# Altium project control_panel_PCB.PrjPcb
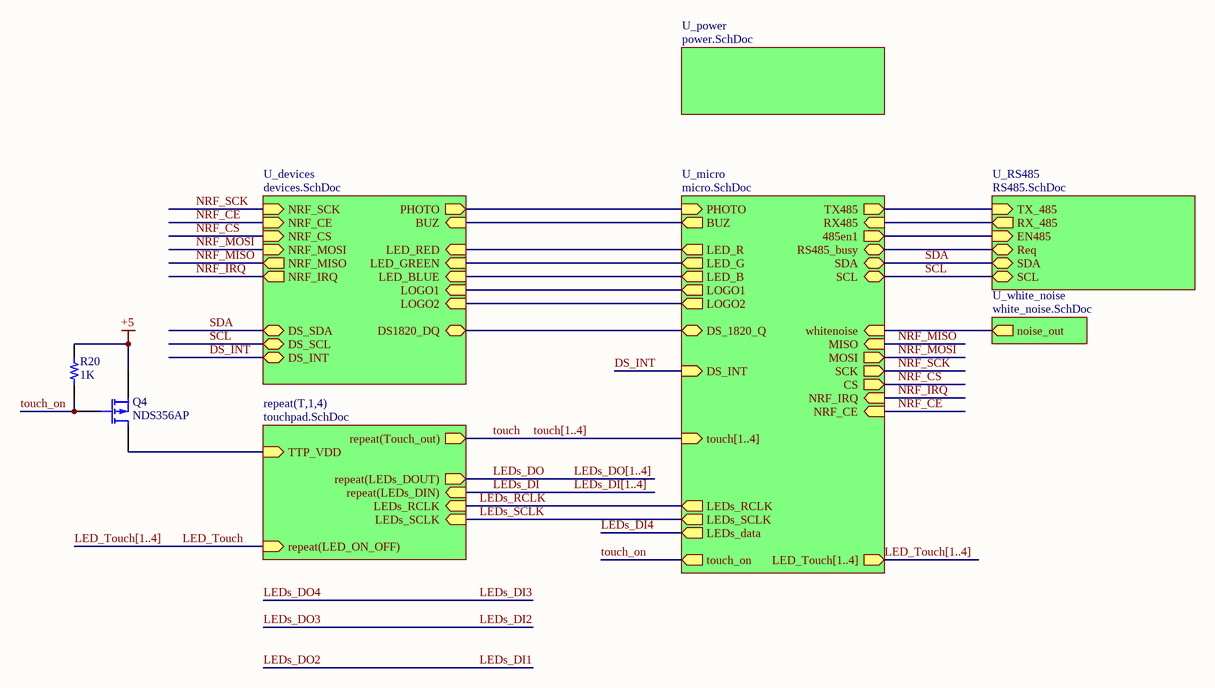
[diagram p0: top.SchDoc]
7 sheets, 279 parts. Net scope: hierarchical (ports join the sheet entries above them; power ports are global).
Board files: control_panel2.PcbDoc, control_panel.PcbDoc
Sheets:
  top.SchDoc
    U_micro = micro.SchDoc
    U_power = power.SchDoc
    U_RS485 = RS485.SchDoc
    U_white_noise = white_noise.SchDoc
    U_devices = devices.SchDoc
    T1 = touchpad.SchDoc
    T2 = touchpad.SchDoc
    T3 = touchpad.SchDoc
    T4 = touchpad.SchDoc

## Sheet top.SchDoc
size A4

### Parts
Q4  NDS356AP  [soT95p280x130-3n]
R20  1K  [0603R]

### Sub-sheets
repeat(T,1,4) = touchpad.SchDoc: TTP_VDD (in), repeat(Touch_out) (out), repeat(LEDs_DIN) (in), repeat(LEDs_DOUT) (out), LEDs_RCLK (in), LEDs_SCLK (in), repeat(LED_ON_OFF) (in)
U_devices = devices.SchDoc: NRF_MISO (out), NRF_SCK (in), NRF_CE (in), NRF_IRQ (out), NRF_CS (in), NRF_MOSI (in), BUZ (in), PHOTO (out), DS_SCL (bidir), DS_SDA (bidir), DS_INT (bidir), DS1820_DQ (bidir), LED_RED (in), LED_GREEN (in), LED_BLUE (in), LOGO1 (in), LOGO2 (in)
U_micro = micro.SchDoc: whitenoise (in), SCL (bidir), SDA (bidir), RX485 (in), TX485 (out), 485en1 (out), RS485_busy (bidir), MISO (in), LED_G (out), SCK (out), NRF_CE (in), LED_B (out), NRF_IRQ (in), DS_1820_Q (bidir), PHOTO (in), DS_INT (in), LED_R (out), MOSI (out), CS (out), BUZ (out), touch_on (out), LEDs_RCLK (out), LEDs_SCLK (out), LEDs_data (out), touch[1..4] (in), LED_Touch[1..4] (out), LOGO1 (out), LOGO2 (out)
U_power = power.SchDoc: no entries
U_RS485 = RS485.SchDoc: RX_485 (out), EN485 (in), TX_485 (in), Req (bidir), SDA (bidir), SCL (bidir)
U_white_noise = white_noise.SchDoc: noise_out (out)

### Nets
+5: Q4.3(S) R20.1
485en: sheet U_micro/485en1, sheet U_RS485/EN485
DS_INT: sheet U_micro/DS_INT, sheet U_devices/DS_INT
LED_Touch: sheet repeat(T,1,4)/repeat(LED_ON_OFF)
LEDs_DI: sheet repeat(T,1,4)/repeat(LEDs_DIN)
LEDs_DO: sheet repeat(T,1,4)/repeat(LEDs_DOUT)
LEDs_RCLK: sheet U_micro/LEDs_RCLK, sheet repeat(T,1,4)/LEDs_RCLK
LEDs_SCLK: sheet U_micro/LEDs_SCLK, sheet repeat(T,1,4)/LEDs_SCLK
NRF_CE: sheet U_micro/NRF_CE, sheet U_devices/NRF_CE
NRF_CS: sheet U_micro/CS, sheet U_devices/NRF_CS  [project net CS]
NRF_IRQ: sheet U_micro/NRF_IRQ, sheet U_devices/NRF_IRQ
NRF_MISO: sheet U_micro/MISO, sheet U_devices/NRF_MISO  [project net MISO]
NRF_MOSI: sheet U_micro/MOSI, sheet U_devices/NRF_MOSI  [project net MOSI]
NRF_SCK: sheet U_micro/SCK, sheet U_devices/NRF_SCK
photo: sheet U_micro/PHOTO, sheet U_devices/PHOTO
RS48_busy: sheet U_micro/RS485_busy, sheet U_RS485/Req
RX485: sheet U_micro/RX485, sheet U_RS485/RX_485
SCL: sheet U_micro/SCL, sheet U_RS485/SCL, sheet U_devices/DS_SCL
SDA: sheet U_micro/SDA, sheet U_RS485/SDA, sheet U_devices/DS_SDA
touch: sheet repeat(T,1,4)/repeat(Touch_out)  [also labelled touch[1..4]]
touch_on: Q4.2(G) R20.2 ; sheet U_micro/touch_on
TTP_VDD: Q4.1(D) ; sheet repeat(T,1,4)/TTP_VDD
TX485: sheet U_micro/TX485, sheet U_RS485/TX_485
whitenoise: sheet U_micro/whitenoise, sheet U_white_noise/noise_out
NetR26_1: sheet U_micro/DS_1820_Q, sheet U_devices/DS1820_DQ
NetR27_1: sheet U_micro/LED_R, sheet U_devices/LED_RED
NetR27_2: sheet U_micro/LED_G, sheet U_devices/LED_GREEN
NetR27_3: sheet U_micro/LED_B, sheet U_devices/LED_BLUE
NetR27_4: sheet U_micro/LOGO1, sheet U_devices/LOGO1
NetR61_1: sheet U_micro/LOGO2, sheet U_devices/LOGO2
NetSP1_1: sheet U_micro/BUZ, sheet U_devices/BUZ

### Buses and harness runs
bus LED_Touch[1..4]
bus LED_Touch[1..4] = sheet U_micro/LED_Touch[1..4]
bus LEDs_DI[1..4]
bus LEDs_DO[1..4]

### Library data of the parts
Q4 = MOSFET-P: P-Channel MOSFET SOT23; pin to pad: 1>3 2>1 3>2; Published: 8-Jun-2000; LatestRevisionDate: 17-Jul-2002; LatestRevisionNote: Re-released for DXP Platform.; PackageVersion: 1995/1996; PackageReference: E3; Publisher: Altium Limited; PackageDescription: TO, Flat Index; 3 In-Line, Axial Leads; Body Dia. 4.6mm; Lead Dia. 0.5 mm (max)
R20 = Resistor: RES SMD 0603; Part Number: RCS0805100KFKEA; Value: 1K

## Sheet micro.SchDoc
size A3
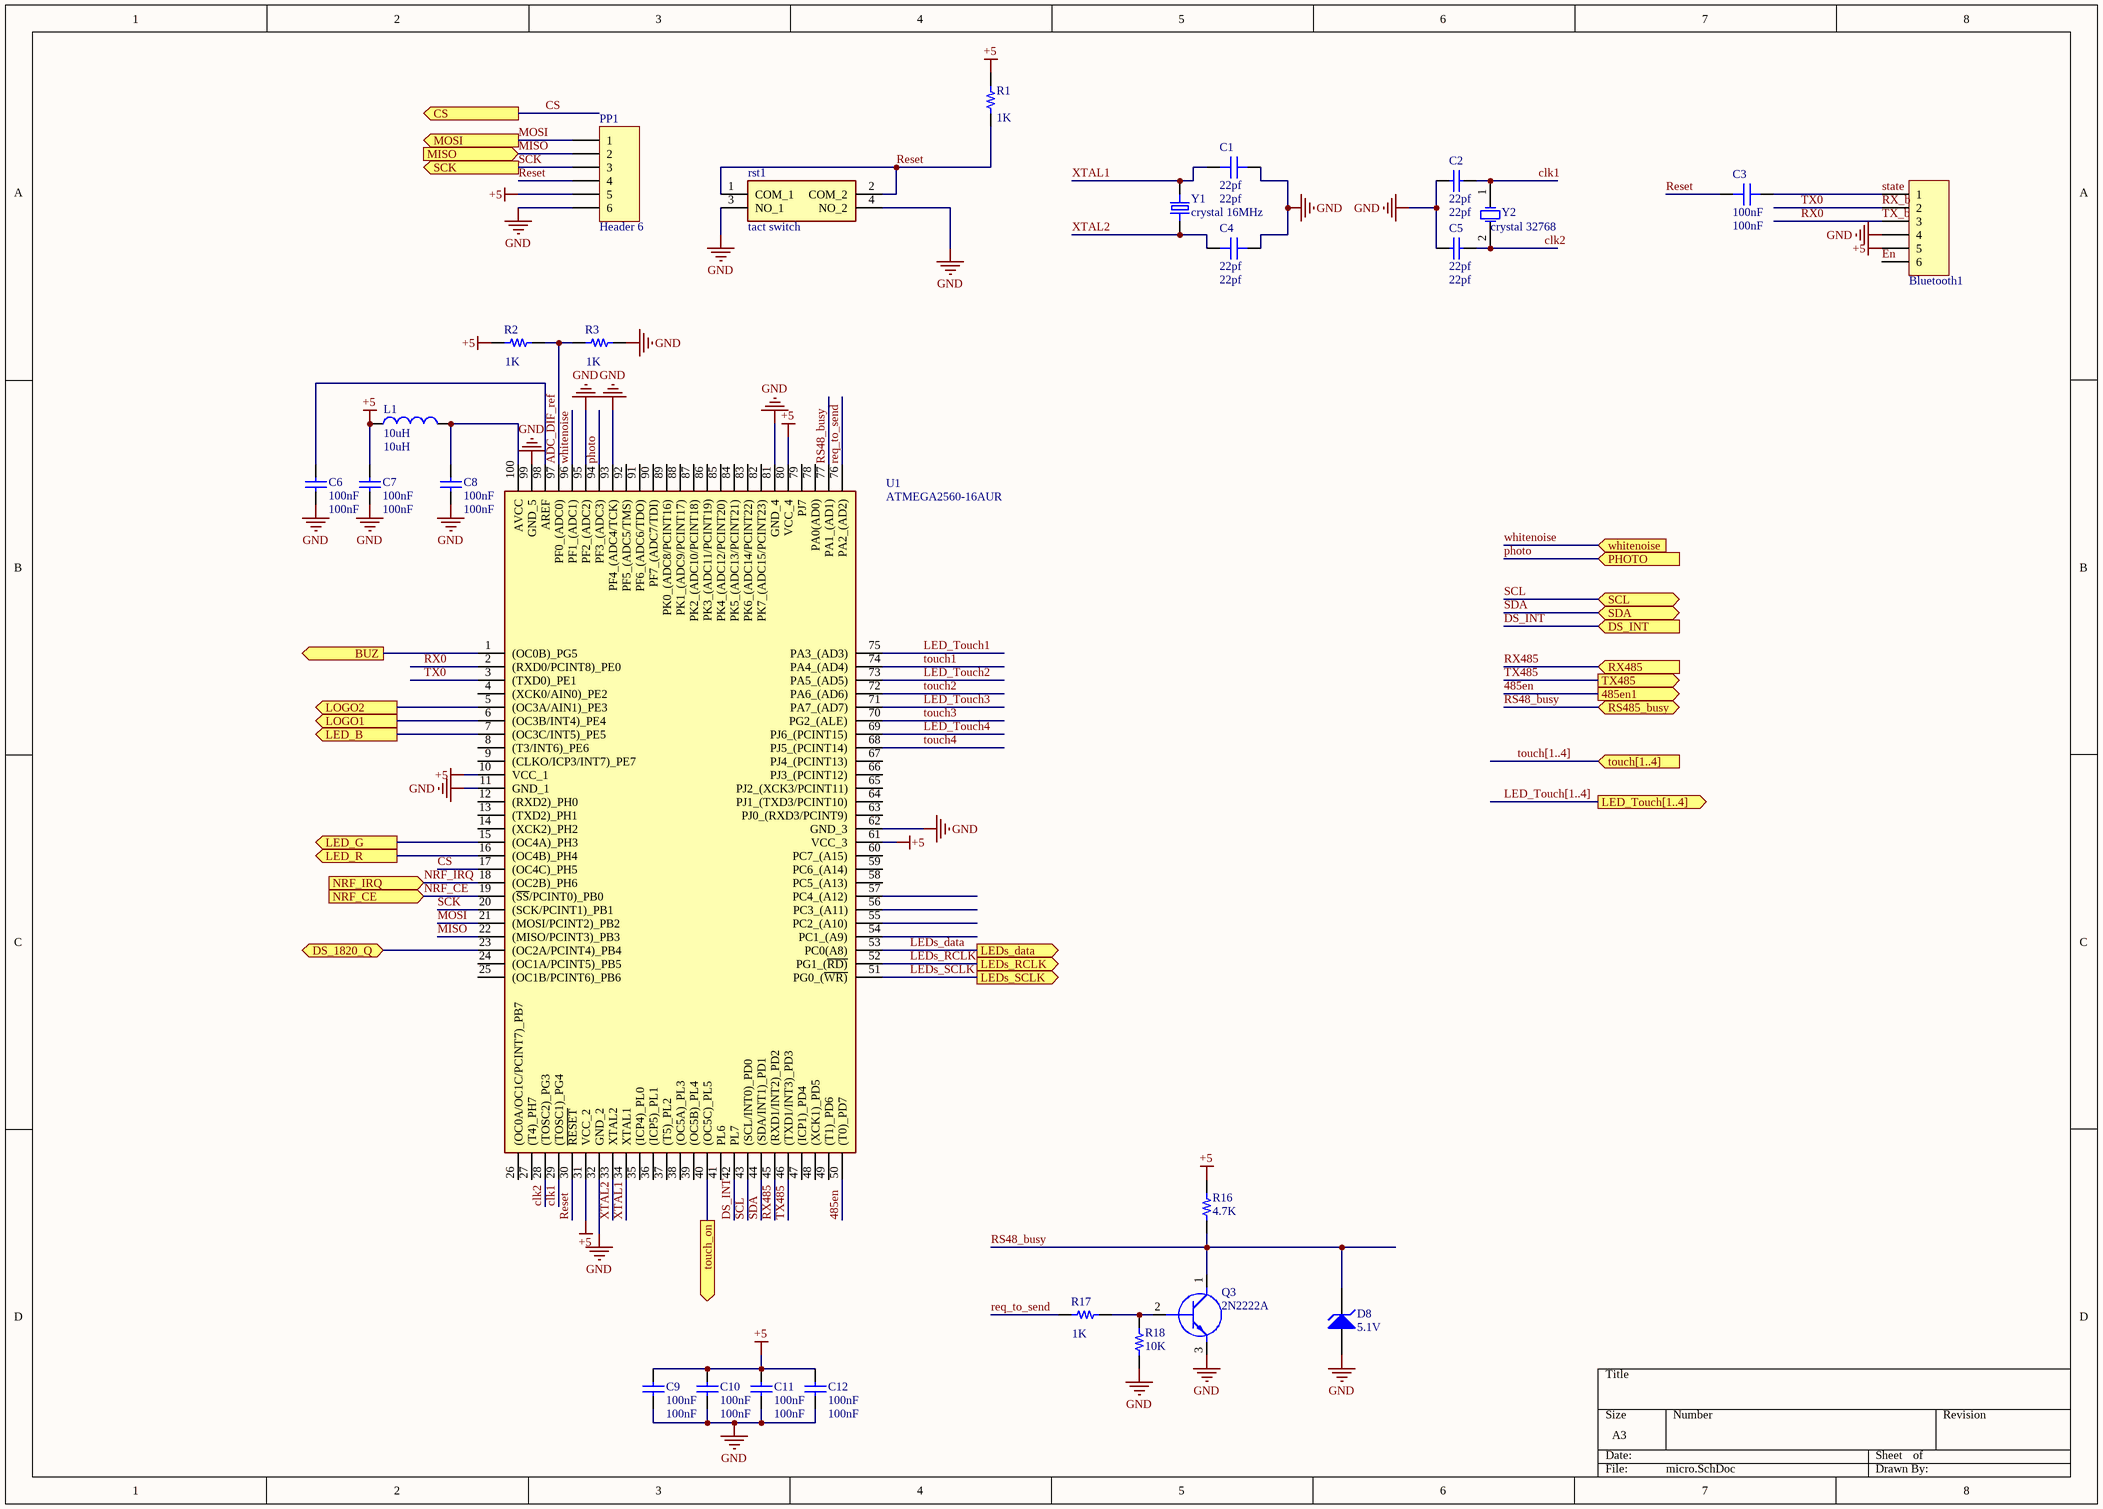
[diagram p1: micro.SchDoc]

### Parts
Bluetooth1  Header 6  [H-1x6]  (value not drawn)
C1  22pf  [0603C]
C2  22pf  [0603C]
C3  100nF  [0603C]
C4  22pf  [0603C]
C5  22pf  [0603C]
C6  100nF  [0603C]
C7  100nF  [0603C]
C8  100nF  [0603C]
C9  100nF  [0603C]
C10  100nF  [0603C]
C11  100nF  [0603C]
C12  100nF  [0603C]
D8  5.1V  [Diode 1n4148 SMD]
L1  10uH  [IND1206]
PP1  Header 6  [HDR1X6]
Q3  2N2222A  [soT95p280x130-3n]
R1  1K  [0603R]
R2  1K  [0603R]
R3  1K  [0603R]
R16  4.7K  [0603R]
R17  1K  [0603R]
R18  10K  [0603R]
rst1  tact switch  [DTSM63NVB]
U1  ATMEGA2560-16AUR  [QFP50P1600X1600X120-100N]
Y1  crystal 16MHz  [XTAL_ECS-180-S-5P-DN-TR]
Y2  crystal 32768  [XTAL RTC]

### Ports
485en1 (out), BUZ (out), CS (out), DS_1820_Q (bidir), DS_INT (in), LED_B (out), LED_G (out), LED_R (out), LED_Touch[1..4] (out), LEDs_data (out), LEDs_RCLK (out), LEDs_SCLK (out), LOGO1 (out), LOGO2 (out), MISO (in), MOSI (out), NRF_CE (in), NRF_IRQ (in), PHOTO (in), RS485_busy (bidir), RX485 (in), SCK (out), SCL (bidir), SDA (bidir), touch[1..4] (in), touch_on (out), TX485 (out), whitenoise (in)

### Nets
+5: Bluetooth1.5 C7.1 C9.1 C10.1 C11.1 C12.1 L1.1 PP1.5 R1.2 R2.2 R16.1 U1.10(VCC_1) U1.31(VCC_2) U1.61(VCC_3) U1.80(VCC_4)
GND: Bluetooth1.4 C1.1 C2.1 C4.1 C5.2 C6.2 C7.2 C8.2 C9.2 C10.2 C11.2 C12.2 D8.1(A) PP1.6 Q3.3(E) R3.1 R18.2 rst1.3(NO_1) rst1.4(NO_2) U1.11(GND_1) U1.32(GND_2) U1.62(GND_3) U1.81(GND_4) U1.93(PF4_(ADC4/TCK)) U1.95(PF2_(ADC2)) U1.99(GND_5)
485en: U1.50((T0)_PD7) ; port 485en1
ADC_DIF_ref: R2.1 R3.2 U1.97(PF0_(ADC0))
clk1: C2.2 U1.29((TOSC1)_PG4) Y2.1(OSC1)
clk2: C5.1 U1.28((TOSC2)_PG3) Y2.2(OSC2)
CS: U1.17((OC4C)_PH5) ; port CS
DS_INT: U1.42(PL7) ; port DS_INT
En: Bluetooth1.6
LED_Touch1: U1.75(PA3_(AD3))
LED_Touch2: U1.73(PA5_(AD5))
LED_Touch3: U1.71(PA7_(AD7))
LED_Touch4: U1.69(PJ6_(PCINT15))
LEDs_data: U1.53(PC0(A8)) ; port LEDs_data
LEDs_RCLK: U1.52(PG1_(~{RD)}) ; port LEDs_RCLK
LEDs_SCLK: U1.51(PG0_(~{WR)}) ; port LEDs_SCLK
MISO: PP1.2 U1.22((MISO/PCINT3)_PB3) ; port MISO
MOSI: PP1.1 U1.21((MOSI/PCINT2)_PB2) ; port MOSI
NRF_CE: U1.19((~{SS}/PCINT0)_PB0) ; port NRF_CE
NRF_IRQ: U1.18((OC2B)_PH6) ; port NRF_IRQ
photo: U1.94(PF3_(ADC3)) ; port PHOTO
req_to_send: R17.2 U1.76(PA2_(AD2))
Reset: C3.2 PP1.4 R1.1 rst1.1(COM_1) rst1.2(COM_2) U1.30(~{RESET})
RS48_busy: D8.2(K) Q3.1(C) R16.2 U1.77(PA1_(AD1)) ; port RS485_busy
RX0: Bluetooth1.3 U1.2((RXD0/PCINT8)_PE0)  [also labelled TX_b]
RX485: U1.45((RXD1/INT2)_PD2) ; port RX485
RX_b: Bluetooth1.2 U1.3((TXD0)_PE1)  [also labelled TX0]
SCK: PP1.3 U1.20((SCK/PCINT1)_PB1) ; port SCK  [project net NRF_SCK]
SCL: U1.43((SCL/INT0)_PD0) ; port SCL
SDA: U1.44((SDA/INT1)_PD1) ; port SDA
state: Bluetooth1.1 C3.1
touch1: U1.74(PA4_(AD4))
touch2: U1.72(PA6_(AD6))
touch3: U1.70(PG2_(ALE))
touch4: U1.68(PJ5_(PCINT14))
touch_on: U1.40((OC5C)_PL5) ; port touch_on
TX485: U1.46((TXD1/INT3)_PD3) ; port TX485
whitenoise: U1.96(PF1_(ADC1)) ; port whitenoise
XTAL1: C1.2 U1.34(XTAL1) Y1.2
XTAL2: C4.2 U1.33(XTAL2) Y1.1
NetC6_1: C6.1 U1.98(AREF)
NetC8_1: C8.1 L1.2 U1.100(AVCC)
NetQ3_2: Q3.2(B) R17.1 R18.1
NetR26_1: U1.23((OC2A/PCINT4)_PB4) ; port DS_1820_Q
NetR27_1: U1.16((OC4B)_PH4) ; port LED_R
NetR27_2: U1.15((OC4A)_PH3) ; port LED_G
NetR27_3: U1.7((OC3C/INT5)_PE5) ; port LED_B
NetR27_4: U1.6((OC3B/INT4)_PE4) ; port LOGO1
NetR61_1: U1.5((OC3A/AIN1)_PE3) ; port LOGO2
NetSP1_1: U1.1((OC0B)_PG5) ; port BUZ

Not connected (* = marked no-connect by the designer): U1 4((XCK0/AIN0)_PE2) 8((T3/INT6)_PE6) 9((CLKO/ICP3/INT7)_PE7) 12((RXD2)_PH0) 13((TXD2)_PH1) 14((XCK2)_PH2) 24((OC1A/PCINT5)_PB5) 25((OC1B/PCINT6)_PB6) 26((OC0A/OC1C/PCINT7)_PB7) 27((T4)_PH7) 35((ICP4)_PL0) 36((ICP5)_PL1) 37((T5)_PL2) 38((OC5A)_PL3) 39((OC5B)_PL4) 41(PL6) 47((ICP1)_PD4) 48((XCK1)_PD5) 49((T1)_PD6) 54(PC1_(A9)) 55(PC2_(A10)) 56(PC3_(A11)) 57(PC4_(A12)) 58(PC5_(A13)) 59(PC6_(A14)) 60(PC7_(A15)) 63(PJ0_(RXD3/PCINT9)) 64(PJ1_(TXD3/PCINT10)) 65(PJ2_(XCK3/PCINT11)) 66(PJ3_(PCINT12)) 67(PJ4_(PCINT13)) 78(PA0(AD0)) 79(PJ7) 82(PK7_(ADC15/PCINT23)) 83(PK6_(ADC14/PCINT22)) 84(PK5_(ADC13/PCINT21)) 85(PK4_(ADC12/PCINT20)) 86(PK3_(ADC11/PCINT19)) 87(PK2_(ADC10/PCINT18)) 88(PK1_(ADC9/PCINT17)) 89(PK0_(ADC8/PCINT16)) 90(PF7_(ADC7/TDI)) 91(PF6_(ADC6/TDO)) 92(PF5_(ADC5/TMS))

### Buses and harness runs
bus LED_Touch[1..4] = port LED_Touch[1..4]
bus touch[1..4] = port touch[1..4]

### Library data of the parts
Bluetooth1 = H-1x6: Header, 6-Pin , female; pin to pad: 2>2.5
C1 C3 C4 = Capacitor: CAP SMD 0603; Part Number: C0805X106K9RAC7800
  C1 C4: Value: 22pf
  C3: Value: 100nF
C2 C5-C12 = Cap: CAP SMD 0603; Published: 8-Jun-2000; LatestRevisionDate: 17-Jul-2002; LatestRevisionNote: Re-released for DXP Platform.; PackageReference: RAD-0.3; Publisher: Altium Limited; PackageDescription: Radial Cap, Thru-Hole; 2 Leads; 0.3 in Pin Spacing
  C2 C5: Value: 22pf
  C6-C12: Value: 100nF
D8 = D Zener: Zener Diode 5.1v; Published: 8-Jun-2000; LatestRevisionDate: 17-Jul-2002; LatestRevisionNote: Re-released for DXP Platform.; PackageReference: DIODE-0.7; Publisher: Altium Limited; PackageDescription: Diode, Thru-Hole; 2 Leads; 0.7 in Pin Spacing
L1 = Inductor: Inductor 1206; Code_IEC: 1005; Published: 8-Jun-2000; LatestRevisionDate: 29-May-2009; LatestRevisionNote: IPC-7351 Footprint Added.; PackageReference: 0402-A; Publisher: Altium Limited; PackageDescription: Chip Inductor; Code_JEITA: 0402; Value: 10uH
PP1 = Header 6: Header, 6-Pin , female; LatestRevisionDate: 17-Jul-2002; LatestRevisionNote: Re-released for DXP Platform.; Publisher: Altium Limited
Q3 = 2N2222A: Transistor BJT NPN SMD; pin to pad: 1>3 2>1 3>2; Manufacturer_Name: Foshan Blue Rocket Elec; Datasheet Link: https://datasheet.lcsc.com/szlcsc/1901291437_Foshan-Blue-Rocket-Elec-2N2222A_C358533.pdf; Height: 4.7mm; Manufacturer_Part_Number: 2N2222A
R1-R3 R16-R18 = Resistor: as R20 on sheet top
  R1-R3 R17: Value: 1K
  R16: Value: 4.7K
  R18: Value: 10K
rst1 = DTSM-66R-V-T_R: Push Button SMD - 4PIN; Manufacturer_Name: Diptronics; Manufacturer_Part_Number: DTSM-66R-V-T/R; Datasheet Link: https://www.mouser.co.uk/datasheet/2/910/464_DTSMJ-6-1571536.pdf; Height: 7.1mm; Mouser Part Number: 113-DTSM66RVTR; Mouser Price/Stock: https://www.mouser.co.uk/ProductDetail/Diptronics/DTSM-66R-V-T-R?qs=MLItCLRbWsxl2%252BVY862AIw%3D%3D
U1 = ATMEGA2560-16AUR: ATMEGA2560-LQFP100; Manufacturer_Name: Microchip; Datasheet Link: http://ww1.microchip.com/downloads/en/DeviceDoc/Atmel-2549-8-bit-AVR-Microcontroller-ATmega640-1280-1281-2560-2561_datasheet.pdf; Height: 1.2mm; Manufacturer_Part_Number: ATMEGA2560-16AUR; Mouser Part Number: 556-ATMEGA2560-16AUR; Mouser Price/Stock: https://www.mouser.co.uk/ProductDetail/Microchip-Technology-Atmel/ATMEGA2560-16AUR?qs=6Dg1WZIWLC5tcX5fO8xzXQ%3D%3D; Arrow Part Number: ATMEGA2560-16AUR; Arrow Price/Stock: https://www.arrow.com/en/products/atmega2560-16aur/microchip-technology?region=nac
Y1 = ECS-180-S-5P-DN-TR: Crystals 16MHz; MF: ECS International; MP: ECS-180-S-5P-DN-TR; Value: 16MHz; SnapEDA_Link: https://www.snapeda.com/parts/ECS-180-S-5P-DN-TR/ECS%20International/view-part/2547669/?ref=snap; Price: None; Package: HC49/US ECS International; Availability: Unavailable
Y2 = XTAL: RTC crystal; Company: E.P.I.L; Value: 32768; Design Date: 11/04/2011

## Sheet power.SchDoc
size A4
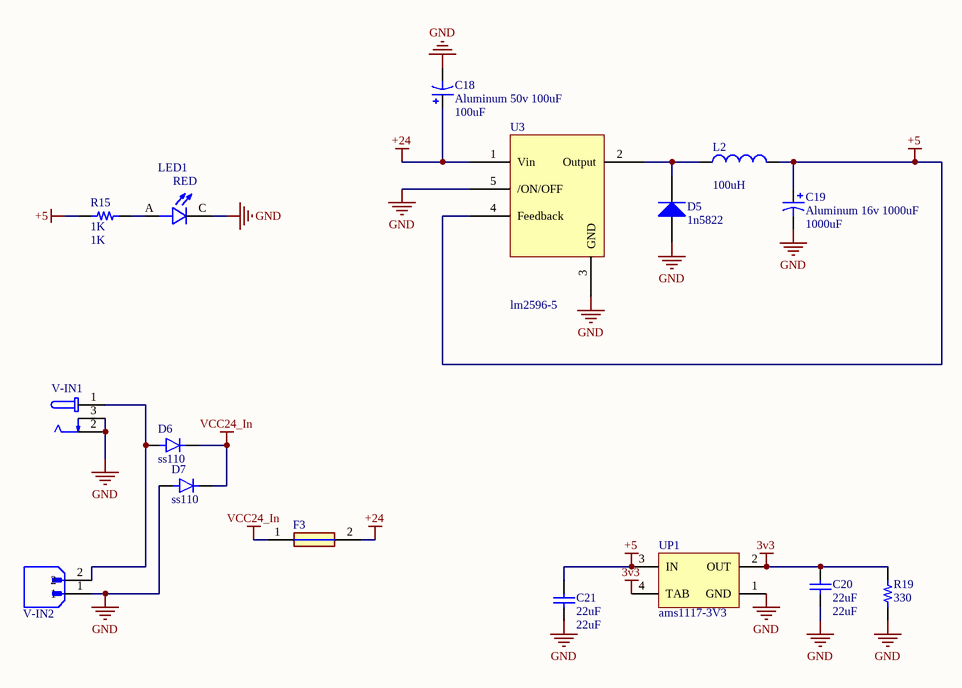
[diagram p2: power.SchDoc]

### Parts
C18  Aluminum 50v 100uF  value 100uF  [Cap SMD 100UF 35~50v]
C19  Aluminum 16v 1000uF  value 1000uF  [CAP SMD 1000UF 16V]
C20  22uF  [0603C]
C21  22uF  [0603C]
D5  1n5822  [SMA DIODE 2]
D6  ss110  [ss110]
D7  ss110  [ss110]
F3  fuse 2amp  [1206 FUSE]  (value not drawn)
L2  value 100uH  [inductor]  (hidden comment: inductor 100uH)
LED1  LED RED  [LED_7012X1]  (value not drawn)
R15  1K  [0603R]
R19  330  [0603R]
U3  lm2596-5  [2596]
UP1  ams1117-3V3  [SOT223]
V-IN1  DC jack power  [GCT_DCJ235-05-A-XX-X_REVA]  (value not drawn)
V-IN2  Phoenix  [AMPHENOL_OQ0271510000G]  (value not drawn)

### Nets
3v3: C20.2 R19.1 UP1.2(OUT) UP1.4(TAB)
+5: C19.1 C21.2 L2.2 R15.1 U3.4(Feedback) UP1.3(IN)
+24: C18.1 F3.2 U3.1(Vin)
GND: C18.2 C19.2 C20.1 C21.1 D5.1(A) D7.A LED1.C R19.2 U3.3(GND) U3.5(/ON/OFF) UP1.1(GND) V-IN1.2 V-IN1.3 V-IN2.1
VCC24_In: D6.C(K) D7.C(K) F3.1
NetD5_2: D5.2(K) L2.1 U3.2(Output)
NetD6_A: D6.A V-IN1.1 V-IN2.2
NetLED1_A: LED1.A R15.2

### Notes on the sheet
- (in symbol 7012X1) RED

### Library data of the parts
C18 C19 = Cap Pol1: CAP POLAR SMD; Published: 8-Jun-2000; LatestRevisionDate: 17-Jul-2002; LatestRevisionNote: Re-released for DXP Platform.; PackageReference: RB7.6-15; Publisher: Altium Limited; PackageDescription: Polarized Capacitor (Radial); 2 Leads
C20 C21 = Cap: CAP SMD 0603; Published: 8-Jun-2000; LatestRevisionDate: 17-Jul-2002; LatestRevisionNote: Re-released for DXP Platform.; PackageReference: RAD-0.3; Publisher: Altium Limited; PackageDescription: Radial Cap, Thru-Hole; 2 Leads; 0.3 in Pin Spacing; Value: 22uF
D5 = Diode 1N4007: 1 Amp schottky Diode SMA; Published: 8-Jun-2000; LatestRevisionDate: 17-Jul-2002; LatestRevisionNote: Re-released for DXP Platform.; DatasheetVersion: 1998; PackageVersion: Aug-1999; PackageReference: DO-41; Publisher: Altium Limited; PackageDescription: Diode, Axial; Body 5.2 x 2.7 mm (LxDia. max), Lead Dia. 0.86 mm (max); Code_JEDEC: DO-204-AL; ComponentLink1Description: Manufacturer Link; ComponentLink1URL: http://www.fairchildsemi.com/; ComponentLink2Description: Datasheet; ComponentLink2URL: http://www.fairchildsemi.com/ds/1N%2F1N4001.pdf
D6 D7 = SBR0560S1-7: Diode Super Barrier 60V 500mA Surface Mount SOD-123; MF: Diodes Inc.; MP: SBR0560S1-7; Availability: Unavailable; SnapEDA_Link: https://www.snapeda.com/parts/SBR0560S1-7/Diodes%20Inc./view-part/491648/?ref=snap; Package: SOD-123 Diodes Inc.; Value: *; Price: None
F3 = 1206SFS200F_63-2: Fuse 1206; Manufacturer_Name: TE Connectivity; Manufacturer_Part_Number: 1206SFS200F/63-2; Datasheet Link: http://docs-emea.rs-online.com/webdocs/13b6/0900766b813b6e27.pdf; Height: 1.17mm
L2 = Inductor: Inductor 12*12mm; Code_IEC: 1005; Published: 8-Jun-2000; LatestRevisionDate: 29-May-2009; LatestRevisionNote: IPC-7351 Footprint Added.; PackageReference: 0402-A; Publisher: Altium Limited; PackageDescription: Chip Inductor; Code_JEITA: 0402
LED1 = 7012X1: LED SMD 0805 RED; Package: None; Price: None; Value: *; MP: 7012X1; Availability: Unavailable
R15 R19 = Resistor: as R20 on sheet top
  R15: Value: 1K
  R19: Value: 330
U3 = lm2596
UP1 = AMS1117-x.x: 3.3 Volt, 800mA SOT-223; Designer: Ali Hafizi; Data: 16-12-2016
V-IN1 = DCJ235-05-A-XX-X_REVA: Dc Power Jack on-board; MF: Global Connector Technology; MP: DCJ235-05-A-K1-A; Price: None; Availability: Unavailable; Package: None; SnapEDA_Link: https://www.snapeda.com/parts/DCJ235-05-A-K1-A/Global%20Connector%20Technology/view-part/813042/?ref=snap; Value: *
V-IN2 = OQ0271510000G: Phoenix Terminal Right 2PIN; MF: Amphenol Anytek; MP: OQ0271510000G; Value: *; Check_prices: https://www.snapeda.com/parts/OQ0271510000G/Amphenol/view-part/4075971/?ref=eda; SnapEDA_Link: https://www.snapeda.com/parts/OQ0271510000G/Amphenol/view-part/4075971/?ref=snap; Price: None; Availability: Warning; Purchase-URL: https://pricing.snapeda.com/search/part/OQ0271510000G/?ref=eda; Package: None

## Sheet RS485.SchDoc
size A4
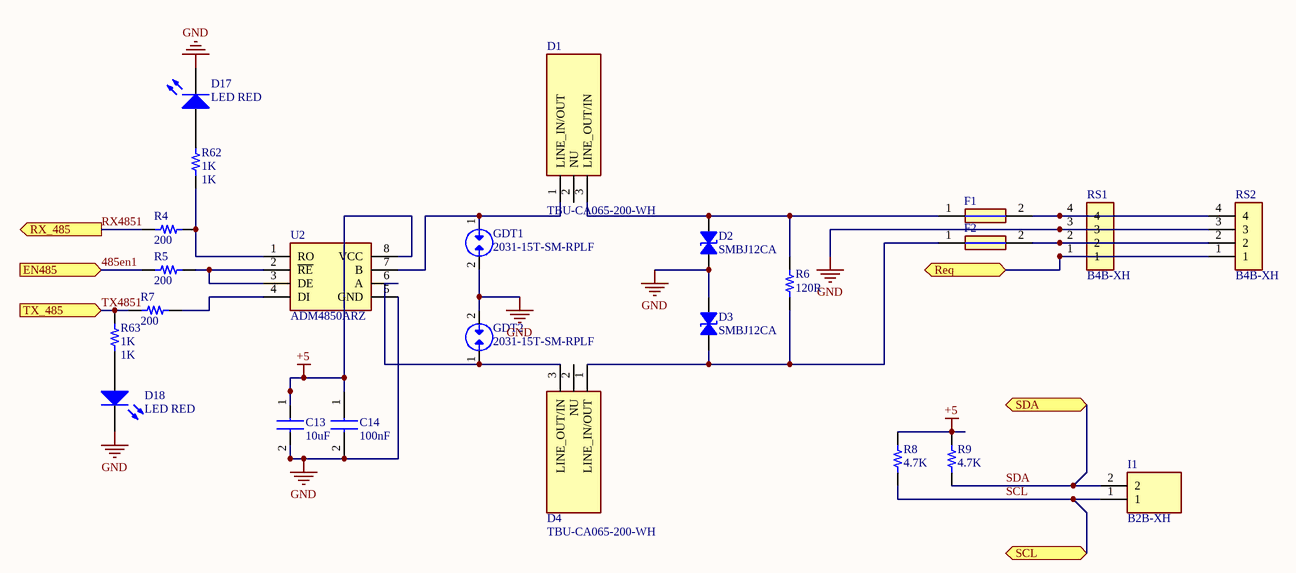
[diagram p3: RS485.SchDoc]

### Parts
C13  10uF  [0603C]
C14  100nF  [0603C]
D1  TBU-CA065-200-WH  [TBUCA025050WH]
D2  SMBJ12CA  [DO214AA SMB]
D3  SMBJ12CA  [DO214AA SMB]
D4  TBU-CA065-200-WH  [TBUCA025050WH]
D17  LED RED  [LED_0805 G]
D18  LED RED  [LED_0805 G]
F1  fuse 100mAmp  [1206 FUSE]  (value not drawn)
F2  fuse 100mAmp  [1206 FUSE]  (value not drawn)
GDT1  2031-15T-SM-RPLF  [TVS_2031-15T-SM-RPLF]
GDT2  2031-15T-SM-RPLF  [TVS_2031-15T-SM-RPLF]
I1  B2B-XH  [JST-B2B-XH]
R4  200  [0603R]
R5  200  [0603R]
R6  120R  [0603R]
R7  200  [0603R]
R8  4.7K  [0603R]
R9  4.7K  [0603R]
R62  1K  [0603R]
R63  1K  [0603R]
RS1  B4B-XH  [JST-B4B-XH]
RS2  B4B-XH  [JST-B4B-XH]
U2  ADM4850ARZ  [SO8_N]

### Ports
EN485 (in), Req (bidir), RX_485 (out), SCL (bidir), SDA (bidir), TX_485 (in)

### Nets
+5: C13.1 C14.1 R8.1 R9.1 U2.8(VCC)
GND: C13.2 C14.2 D2.1 D3.2 D17.2(K) D18.2(K) GDT1.2 GDT2.2 RS1.3 RS2.3 U2.5(GND)
485en1: R5.2 ; port EN485  [project net 485en]
RS48_busy: RS1.1 RS2.1 ; port Req
RX4851: R4.2 ; port RX_485  [project net RX485]
SCL: I1.1 R8.2 ; port SCL
SDA: I1.2 R9.2 ; port SDA
TX4851: R7.2 R63.2 ; port TX_485  [project net TX485]
NetD1_1: D1.1(LINE_IN/OUT) GDT1.1 U2.7(B)
NetD1_3: D1.3(LINE_OUT/IN) D2.2 F1.1 R6.1
NetD3_1: D3.1 D4.1(LINE_IN/OUT) F2.1 R6.2
NetD4_3: D4.3(LINE_OUT/IN) GDT2.1 U2.6(A)
NetD17_1: D17.1(A) R62.1
NetD18_1: D18.1(A) R63.1
NetF1_2: F1.2 RS1.4 RS2.4
NetF2_2: F2.2 RS1.2 RS2.2
NetR4_1: R4.1 R62.2 U2.1(RO)
NetR5_1: R5.1 U2.2(~{RE}) U2.3(DE)
NetR7_1: R7.1 U2.4(DI)

Not connected (* = marked no-connect by the designer): D1 2(NU); D4 2(NU)

### Library data of the parts
C13 C14 = C1206C104Z5UACTU: CAP SMD 0603; Manufacturer_Name: Kemet; Datasheet Link: https://componentsearchengine.com/Datasheets/1/C1206C104Z5UACTU.pdf; Height: 0.88mm; Manufacturer_Part_Number: C1206C104Z5UACTU; Mouser Part Number: 80-C1206C104Z5U; Mouser Price/Stock: https://www.mouser.com/Search/Refine.aspx?Keyword=80-C1206C104Z5U
D1 D4 = TBU-CA065-200-WH: TVS Diode (Bi-directional); Manufacturer_Name: Bourns; Datasheet Link: https://www.bourns.com/data/global/pdfs/TBU-CA.pdf; Height: 1mm; Manufacturer_Part_Number: TBU-CA065-200-WH; Mouser Part Number: 652-TBU-CA065-200-WH; Mouser Price/Stock: https://www.mouser.co.uk/ProductDetail/Bourns/TBU-CA065-200-WH?qs=kLtMOTa49OkdVs42fYbv8A%3D%3D; Arrow Part Number: TBU-CA065-200-WH; Arrow Price/Stock: https://www.arrow.com/en/products/tbu-ca065-200-wh/bourns?region=nac
D2 D3 = SMBJ12CA: TVS DIODE 12V 19.9V SMB; Manufacturer: AVX Corporation; Bidirectional Channels: 1; Current - Peak Pulse (10/1000µs): 30.15A; Power Line Protection: No; Power - Peak Pulse: 600W; Type: Zener; Voltage - Breakdown (Min): 13.3V; Part Number: SMBJ12CA; Applications: General Purpose; ComponentLink1Description: Datasheet; ComponentLink1URL: //media.digikey.com/pdf/Data%20Sheets/AVX%20PDFs/Transient%20Suppression%20Diodes.pdf; ComponentLink2Description: DigiKey Link; ComponentLink2URL: http://digikey.com/product-detail/en/avx-corporation/SMBJ12CA/478-7062-1-ND/3340353; LastUpdated: 9/2/2020 1:28:17 AM; Lifecycle Status: Active; Minimum Order: 1; Mounting Type: Surface Mount; Operating Temperature: -55°C ~ 150°C (TJ); Package / Case: DO-214AA, SMB; Packaging: TapeAndReel; PartId: 9012; Part Status: Active; Price: 0.16; Series: -; Supplier 1: DigiKey; Supplier Part Number 1: 478-7062-1-ND; Supplier Device Package: SMB; Voltage - Clamping (Max) @ Ipp: 19.9V; Voltage - Reverse Standoff (Typ): 12V
D17 D18 = LED0: LED SMD 0805 RED; Published: 8-Jun-2000; LatestRevisionDate: 08-Jul-2005; LatestRevisionNote: Mech Layer 1 removed.; PackageReference: LED-0; Publisher: Altium Limited; PackageDescription: LED; 2 Leads
F1 F2 = 1206SFS200F_63-2: as F3 on sheet power; Datasheet Link: http://docs-emea.rs-online.com/webdocs/13b6/0900766b813b6e27.pdf; Height: 1.17mm
GDT1 GDT2 = 2031-15T-SM-RPLF: Gas Discharge Tube SMD; Package: None; Price: None; Value: *; MP: 2031-15T-SM-RPLF; Availability: Unavailable
I1 = B2B-XH: XH 2pin standing
R4-R9 = CRCW080510K0JNEAIF: RES SMD 0603; Manufacturer: Vishay Dale; Power (Watts): 0.125W, 1/8W; Resistance: 10 kOhms; Temperature Coefficient: ±200ppm/°C; Tolerance: ±5%; Part Number: CRCW080510K0JNEAIF; ComponentLink1Description: Datasheet; ComponentLink1URL: http://www.vishay.com/docs/20024/dcrcwife3.pdf; ComponentLink2Description: DigiKey Link; ComponentLink2URL: http://digikey.com/product-detail/en/vishay-dale/CRCW080510K0JNEAIF/541-10KAPCT-ND/3477322; Composition: Thick Film; Device Package: 0805 (2012 Metric); Features: Automotive AEC-Q200, Pulse Withstanding; Height - Seated (Max): 0.020" (0.50mm); LastUpdated: 9/2/2020 1:14:55 AM; Lifecycle Status: Active; Minimum Order: 1; Number of Terminations: 2; Operating Temperature: -55°C ~ 155°C; Package / Case: 0805 (2012 Metric); Packaging: TapeAndReel; PartId: 40891; Part Status: Active; Price: 0.08; Ratings: AEC-Q200; Series: CRCW-IF; Size / Dimension: 0.079" L x 0.049" W (2.00mm x 1.25mm); Supplier 1: DigiKey; Supplier Part Number 1: 541-10KAPCT-ND; Supplier Device Package: 0805
  R4 R5 R7: Value: 200
  R6: Value: 120R
  R8 R9: Value: 4.7K
R62 R63 = Resistor: as R20 on sheet top; Value: 1K
RS1 RS2 = B4B-XH: XH 4pin standing
U2 = ADM4850ARZ: MAX485 SMD; Manufacturer_Name: Analog Devices; Datasheet Link: http://www.analog.com/static/imported-files/data_sheets/ADM4850_4851_4852_4853_4854_4855_4856_4857.pdf; Height: 1.75mm; Manufacturer_Part_Number: ADM4850ARZ; Mouser Part Number: 584-ADM4850ARZ; Mouser Price/Stock: https://www.mouser.com/Search/Refine.aspx?Keyword=584-ADM4850ARZ; Arrow Part Number: ADM4850ARZ; Arrow Price/Stock: https://www.arrow.com/en/products/adm4850arz/analog-devices

## Sheet white_noise.SchDoc
size A4
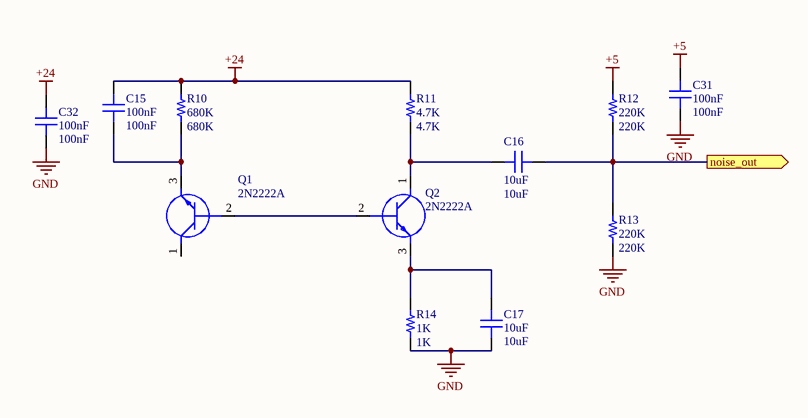
[diagram p4: white_noise.SchDoc]

### Parts
C15  100nF  [cap805]
C16  10uF  [cap805]
C17  10uF  [cap805]
C31  100nF  [cap805]
C32  100nF  [cap805]
Q1  2N2222A  [soT95p280x130-3n]
Q2  2N2222A  [soT95p280x130-3n]
R10  680K  [0603R]
R11  4.7K  [0603R]
R12  220K  [0603R]
R13  220K  [0603R]
R14  1K  [0603R]

### Ports
noise_out (out)

### Nets
+5: C31.1 R12.2
+24: C15.2 C32.1 R10.2 R11.2
GND: C17.1 C31.2 C32.2 R13.1 R14.1
whitenoise: C16.1 R12.1 R13.2 ; port noise_out
NetC15_1: C15.1 Q1.3(E) R10.1
NetC16_2: C16.2 Q2.1(C) R11.1
NetC17_2: C17.2 Q2.3(E) R14.2
NetQ1_2: Q1.2(B) Q2.2(B)

Not connected (* = marked no-connect by the designer): Q1 1(C)

### Library data of the parts
C15-C17 C31 C32 = Capacitor: CAP SMD 0805; Part Number: C0805X106K9RAC7800
  C15 C31 C32: Value: 100nF
  C16 C17: Value: 10uF
Q1 Q2 = 2N2222A: Transistor BJT NPN SMD; pin to pad: 1>3 2>1 3>2; Manufacturer_Name: Foshan Blue Rocket Elec; Datasheet Link: https://datasheet.lcsc.com/szlcsc/1901291437_Foshan-Blue-Rocket-Elec-2N2222A_C358533.pdf; Height: 4.7mm; Manufacturer_Part_Number: 2N2222A
R10-R14 = Resistor: as R20 on sheet top
  R10: Value: 680K
  R11: Value: 4.7K
  R12 R13: Value: 220K
  R14: Value: 1K

## Sheet devices.SchDoc
size A3
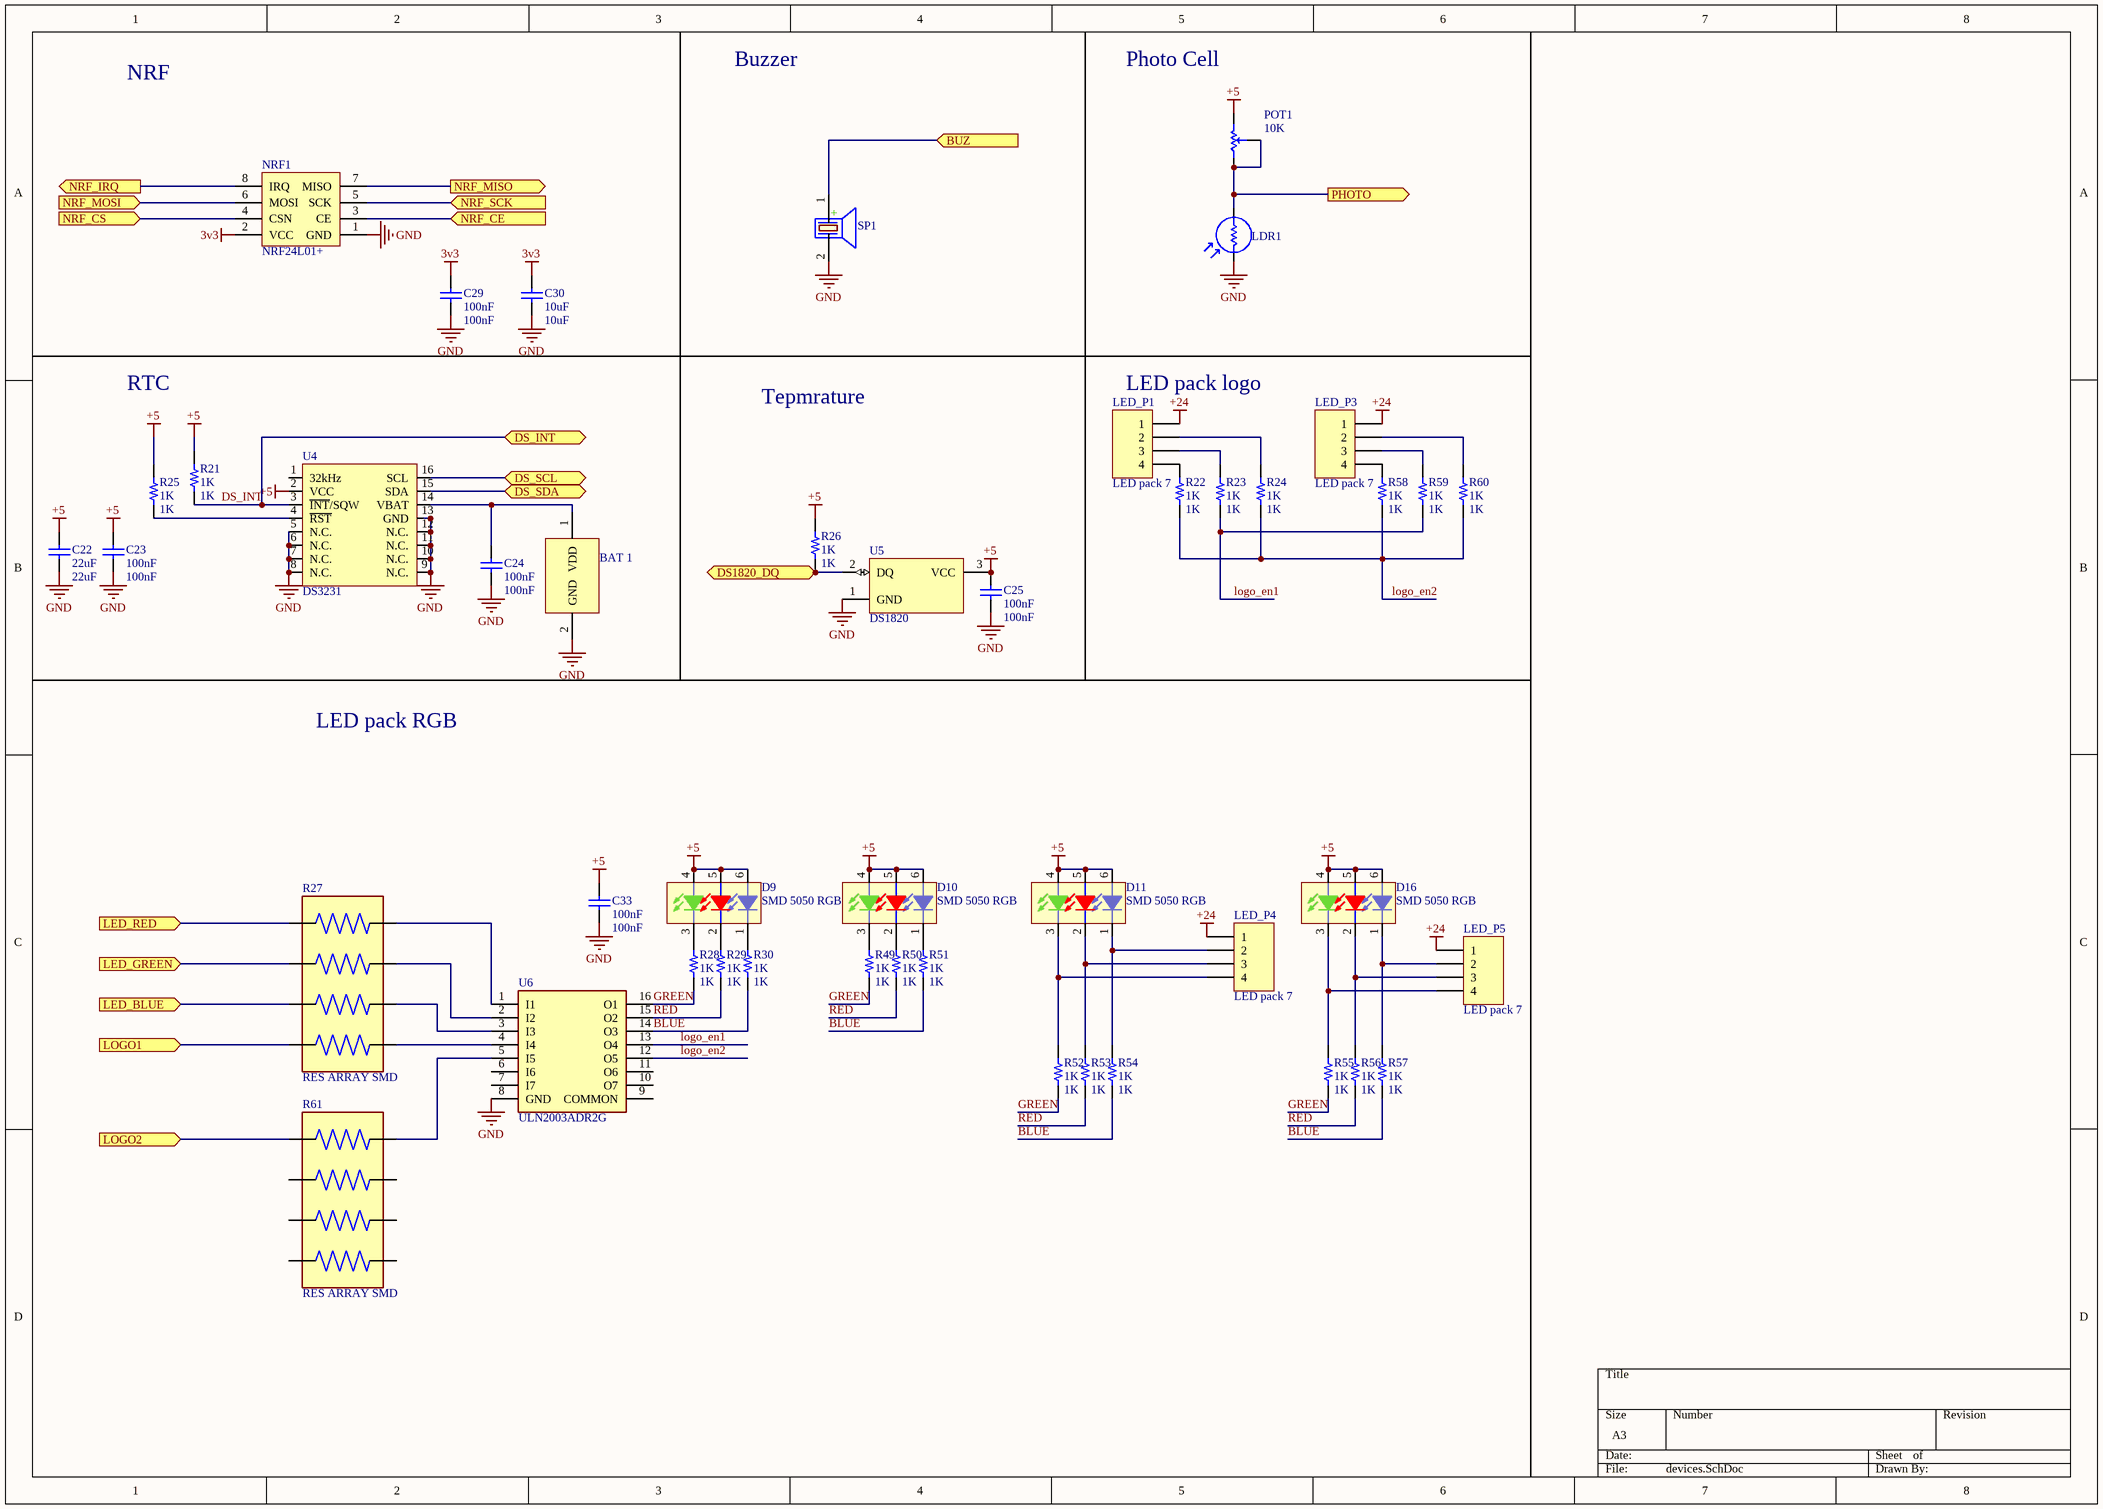
[diagram p5: devices.SchDoc]

### Parts
BAT_1  BAT Backup  [BATTERY_coin]  (value not drawn)
C22  22uF  [0603C]
C23  100nF  [0603C]
C24  100nF  [0603C]
C25  100nF  [0603C]
C29  100nF  [0603C]
C30  10uF  [0603C]
C33  100nF  [0603C]
D9  Comment_1: SMD 5050 RGB  [5050 LED package]  (hidden comment: 5050RGB)
D10  Comment_1: SMD 5050 RGB  [5050 LED package]  (hidden comment: 5050RGB)
D11  Comment_1: SMD 5050 RGB  [5050 LED package]  (hidden comment: 5050RGB)
D16  Comment_1: SMD 5050 RGB  [5050 LED package]  (hidden comment: 5050RGB)
LDR1  PhotoCell-5mm  [PhotoCell]  (value not drawn)
LED_P1  LED pack 7  [LED_PAKC_7]
LED_P3  LED pack 7  [LED_PAKC_7]
LED_P4  LED pack 7  [LED_PAKC_7]
LED_P5  LED pack 7  [LED_PAKC_7]
NRF1  NRF24L01+  [NRF24L01P]
POT1  10K  [POT 2]
R21  1K  [0603R]
R22  1K  [RES1812]
R23  1K  [RES1812]
R24  1K  [RES1812]
R25  1K  [0603R]
R26  1K  [0603R]
R27  RES ARRAY SMD  [RESCAXE80P320X160X70-8N]
R28  1K  [0603R]
R29  1K  [0603R]
R30  1K  [0603R]
R49  1K  [0603R]
R50  1K  [0603R]
R51  1K  [0603R]
R52  1K  [RES1812]
R53  1K  [RES1812]
R54  1K  [RES1812]
R55  1K  [RES1812]
R56  1K  [RES1812]
R57  1K  [RES1812]
R58  1K  [RES1812]
R59  1K  [RES1812]
R60  1K  [RES1812]
R61  RES ARRAY SMD  [RESCAXE80P320X160X70-8N]
SP1  BUZZER  [BUZZER 7.62mm DC]  (value not drawn)
U4  DS3231  [SO-16W]
U5  DS1820  [DS1820]
U6  ULN2003ADR2G  [SOIC127P600X175-16N]

### Ports
BUZ (in), DS1820_DQ (bidir), DS_INT (bidir), DS_SCL (bidir), DS_SDA (bidir), LED_BLUE (in), LED_GREEN (in), LED_RED (in), LOGO1 (in), LOGO2 (in), NRF_CE (in), NRF_CS (in), NRF_IRQ (out), NRF_MISO (out), NRF_MOSI (in), NRF_SCK (in), PHOTO (out)

### Nets
3v3: C29.2 C30.2 NRF1.2(VCC)
+5: C22.2 C23.2 C25.2 C33.2 D9.4 D9.5 D9.6 D10.4 D10.5 D10.6 D11.4 D11.5 D11.6 D16.4 D16.5 D16.6 POT1.2(CW) R21.2 R25.2 R26.2 U4.2(VCC) U5.3(VCC)
+24: LED_P1.1 LED_P3.1 LED_P4.1 LED_P5.1
GND: BAT_1.2(GND) C22.1 C23.1 C24.1 C25.1 C29.1 C30.1 C33.1 LDR1.1 NRF1.1(GND) SP1.2(-) U4.5(N.C.) U4.6(N.C.) U4.7(N.C.) U4.8(N.C.) U4.9(N.C.) U4.10(N.C.) U4.11(N.C.) U4.12(N.C.) U4.13(GND) U5.1(GND) U6.8(GND)
BLUE: R30.1 R51.1 R54.1 R57.1 U6.14(O3)
CS: NRF1.4(CSN) ; port NRF_CS
DS_INT: R21.1 U4.3(~{INT}/SQW) ; port DS_INT
GREEN: R28.1 R49.1 R52.1 R55.1 U6.16(O1)
logo_en1: R23.1 R59.1 U6.13(O4)
logo_en2: R22.2 R24.1 R58.2 R60.1 U6.12(O5)
MISO: NRF1.7(MISO) ; port NRF_MISO
MOSI: NRF1.6(MOSI) ; port NRF_MOSI
NRF_CE: NRF1.3(CE) ; port NRF_CE
NRF_IRQ: NRF1.8(IRQ) ; port NRF_IRQ
NRF_SCK: NRF1.5(SCK) ; port NRF_SCK
photo: LDR1.2 POT1.1(CCW) POT1.3(SetPoint) ; port PHOTO
RED: R29.1 R50.1 R53.1 R56.1 U6.15(O2)
SCL: U4.16(SCL) ; port DS_SCL
SDA: U4.15(SDA) ; port DS_SDA
NetBAT_1_1: BAT_1.1(VDD) C24.2 U4.14(VBAT)
NetD9_1: D9.1 R30.2
NetD9_2: D9.2 R29.2
NetD9_3: D9.3 R28.2
NetD10_1: D10.1 R51.2
NetD10_2: D10.2 R50.2
NetD10_3: D10.3 R49.2
NetD11_1: D11.1 LED_P4.2 R54.2
NetD11_2: D11.2 LED_P4.3 R53.2
NetD11_3: D11.3 LED_P4.4 R52.2
NetD16_1: D16.1 LED_P5.2 R57.2
NetD16_2: D16.2 LED_P5.3 R56.2
NetD16_3: D16.3 LED_P5.4 R55.2
NetLED_P1_2: LED_P1.2 R24.2
NetLED_P1_3: LED_P1.3 R23.2
NetLED_P1_4: LED_P1.4 R22.1
NetLED_P3_2: LED_P3.2 R60.2
NetLED_P3_3: LED_P3.3 R59.2
NetLED_P3_4: LED_P3.4 R58.1
NetR25_1: R25.1 U4.4(~{RST})
NetR26_1: R26.1 U5.2(DQ) ; port DS1820_DQ
NetR27_1: R27.1 ; port LED_RED
NetR27_2: R27.2 ; port LED_GREEN
NetR27_3: R27.3 ; port LED_BLUE
NetR27_4: R27.4 ; port LOGO1
NetR27_5: R27.5 U6.4(I4)
NetR27_6: R27.6 U6.3(I3)
NetR27_7: R27.7 U6.2(I2)
NetR27_8: R27.8 U6.1(I1)
NetR61_1: R61.1 ; port LOGO2
NetR61_8: R61.8 U6.5(I5)
NetSP1_1: SP1.1(+) ; port BUZ

Not connected (* = marked no-connect by the designer): R61 2 3 4 5 6 7; U4 1(32kHz); U6 6(I6) 7(I7) 9(COMMON) 10(O7) 11(O6)

### Notes on the sheet
- NRF
- Buzzer
- Photo Cell
- RTC
- Tepmrature
- (near LED_P1) LED pack logo
- LED pack RGB

### Library data of the parts
BAT_1 = BAT Backup: COIL CELL CR1220
C22-C25 C29 C30 C33 = Cap: CAP SMD 0603; Published: 8-Jun-2000; LatestRevisionDate: 17-Jul-2002; LatestRevisionNote: Re-released for DXP Platform.; PackageReference: RAD-0.3; Publisher: Altium Limited; PackageDescription: Radial Cap, Thru-Hole; 2 Leads; 0.3 in Pin Spacing
  C22: Value: 22uF
  C23-C25 C29 C33: Value: 100nF
  C30: Value: 10uF
D9-D11 D16 = LED SMD 5050 RGB: SMD 5050 RGB LED; Designer: Abbas Basereh; Design Date: 1395/11/10; ComponentLink1Description: SMD 5050 RGB; ComponentLink1URL: http://www.yuanlei-led.com; ComponentLink2Description: Reference; PackageDescription: SMD 5050 RGB; Publisher: Abbas Basereh; Mounting Technology: Surface Mount; HelpURL: probably color of the leds not mached real please check and change; Pin Count: 6; Status: Unreleased
LDR1 = LDR: Photo Cell- Variable Resistor With Light; Company: IPA CO.; Designer: Saeid Jorablo; Last Update Time: 2008/07/17
LED_P1 LED_P3-LED_P5 = Header 4: 7led-red white LED pack; LatestRevisionDate: 17-Jul-2002; LatestRevisionNote: Re-released for DXP Platform.; Publisher: Altium Limited
NRF1 = NRF24L01P: NRF Module; Ali Hafizi: Creature
POT1 = POT: Variable Resistor; Value: 10K
R21 R25 R26 R28-R30 R49-R51 = Resistor: as R20 on sheet top; Value: 1K
R22-R24 R52-R60 = Resistor: RES SMD 1812; Part Number: RCS0805100KFKEA; Value: 1K
R27 R61 = YC164-JR-07330RL: RES Array 0603-4x 100 to 200 OHM; MF: Yageo; SnapEDA_Link: https://www.snapeda.com/parts/YC164-JR-07330RL/Yageo/view-part/106017/?ref=snap; Price: None; Mouser-Purchase-URL: https://snapeda.com/shop?store=Mouser&id=106017; DigiKey-Purchase-URL: https://snapeda.com/shop?store=DigiKey&id=106017; Value: *; MP: YC164-JR-07330RL; Package: 1206 Yageo; Availability: Unavailable
SP1 = PIEZO BUZZER: PIEZO BUZZER 5VOLTS; Designer: Abbas Basereh; Comment_1: SPEAKER AND BEEP; Design Date: 1395/11/14; ComponentLink2Description: Reference; PackageDescription: THD; Publisher: Abbas Basereh; Mounting Technology: THD; Pin Count: 2; Status: Unreleased
U4 = DS3231: DS3231 RTC
U5 = DS1820: 1-Wire Digital Thermometer; ComponentAvailability: Obsolete; Published: 13-Oct-2000; LatestRevisionDate: 17-Jul-2002; LatestRevisionNote: Re-released for DXP Platform.; DatasheetVersion: 5-Mar-1998; PackageVersion: 1999; PackageReference: PR35; Publisher: Altium Limited; PackageDescription: TO, Flat Index; 3 In-Line, Axial Leads; Body Dia. 4.6mm; Leads 0.56 x 0.51 mm (max); ComponentLink1Description: Manufacturer Link; ComponentLink1URL: http://www.maxim-ic.com/; ComponentLink2Description: Datasheet; ComponentLink2URL: http://pdfserv.maxim-ic.com/en/ds/DS1820-DS1820S.pdf; ComponentLink3Description: Discontinuation Notice; ComponentLink3URL: http://www.maxim-ic.com/qa/pdfs/non-obsolescence-letter.pdf
U6 = ULN2003ADR2G: ULN2003 SMD; Manufacturer_Name: ON Semiconductor; Datasheet Link: http://www.onsemi.com/pub/Collateral/ULN2003A-D.PDF; Height: 1.75mm; Manufacturer_Part_Number: ULN2003ADR2G; Mouser Part Number: 863-ULN2003ADR2G; Mouser Price/Stock: https://www.mouser.co.uk/ProductDetail/onsemi/ULN2003ADR2G?qs=t2BMfLoP1KRgd83C6tnDAg%3D%3D; Arrow Part Number: ULN2003ADR2G; Arrow Price/Stock: https://www.arrow.com/en/products/uln2003adr2g/on-semiconductor?region=europe

## Sheet touchpad.SchDoc
size A4
Used 4 times, as channels T1, T2, T3, T4. Parts and nets are listed once, with the designators drawn on the sheet.
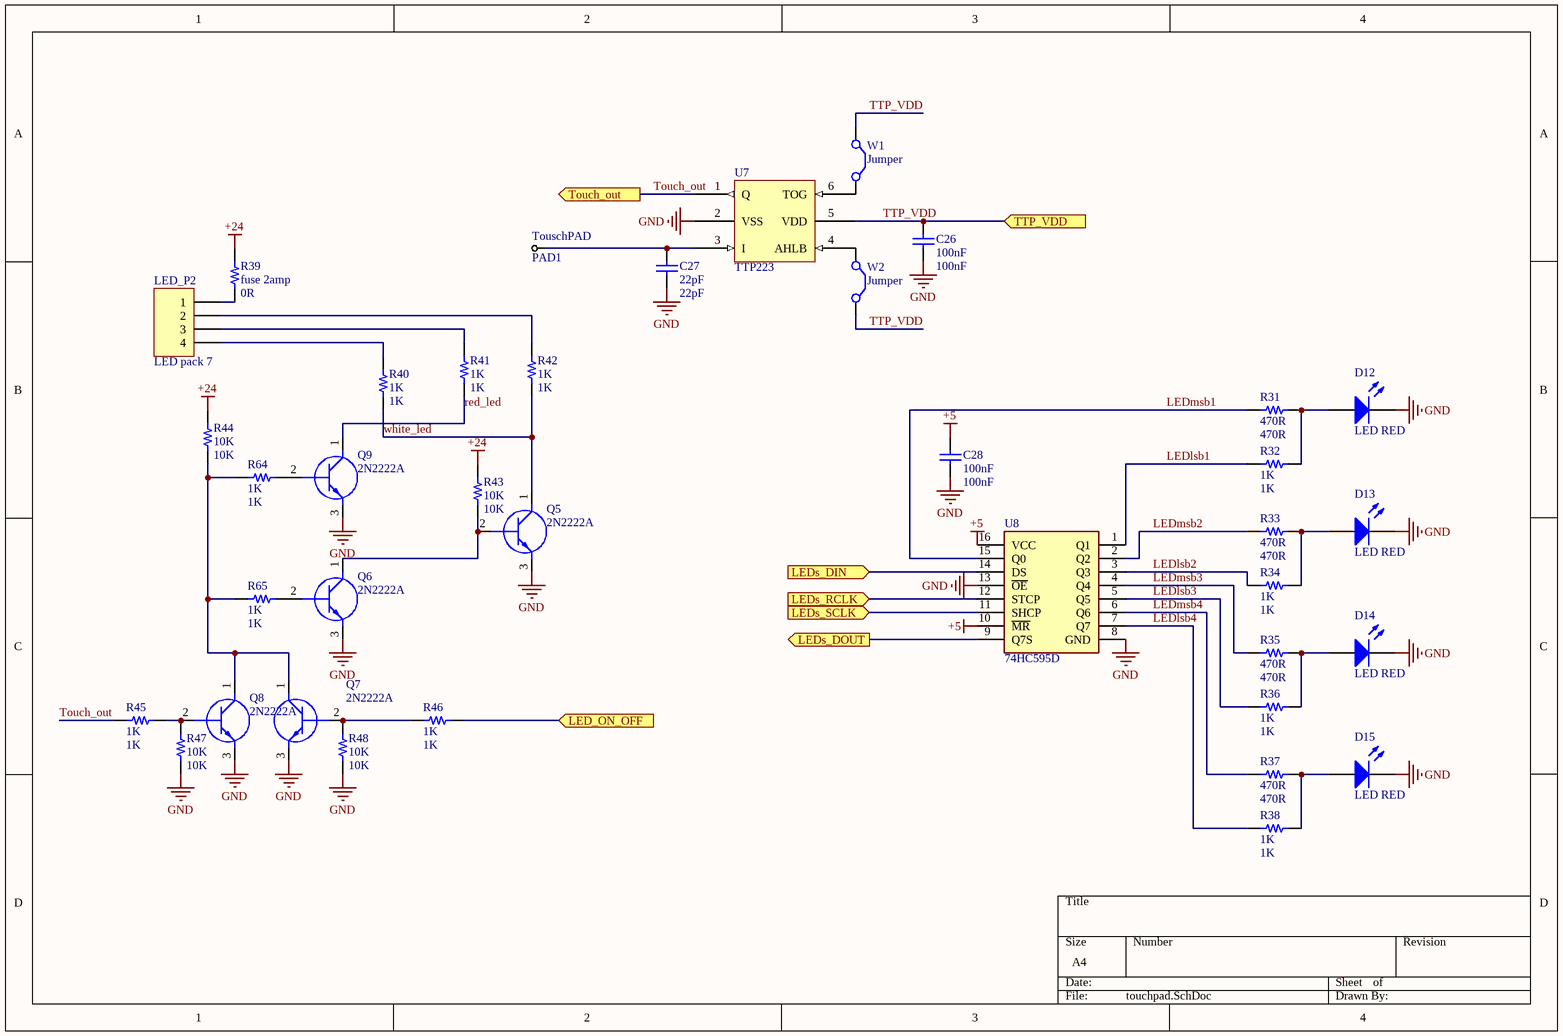
[diagram p6: touchpad.SchDoc]

### Parts
C26  100nF  [0603C]
C27  22pF  [0603C]
C28  100nF  [0603C]
D12  LED RED  [LED_0805 G]
D13  LED RED  [LED_0805 G]
D14  LED RED  [LED_0805 G]
D15  LED RED  [LED_0805 G]
LED_P2  LED pack 7  [LED_PAKC_7]
PAD1  TouschPAD  [touchPAD]  (no BOM)
Q5  2N2222A  [soT95p280x130-3n]
Q6  2N2222A  [soT95p280x130-3n]
Q7  2N2222A  [soT95p280x130-3n]
Q8  2N2222A  [soT95p280x130-3n]
Q9  2N2222A  [soT95p280x130-3n]
R31  470R  [0603R]
R32  1K  [0603R]
R33  470R  [0603R]
R34  1K  [0603R]
R35  470R  [0603R]
R36  1K  [0603R]
R37  470R  [0603R]
R38  1K  [0603R]
R39  fuse 2amp  value 0R  [1206 FUSE]
R40  1K  [RES1812]
R41  1K  [RES1812]
R42  1K  [RES1812]
R43  10K  [0603R]
R44  10K  [0603R]
R45  1K  [0603R]
R46  1K  [0603R]
R47  10K  [0603R]
R48  10K  [0603R]
R64  1K  [0603R]
R65  1K  [0603R]
U7  TTP223  [SOT23-6_L]
U8  74HC595D  [SOIC127P600X175-16N]
W1  Jumper  [JUMPER]  (no BOM)
W2  Jumper  [JUMPER]  (no BOM)

### Ports
LED_ON_OFF (in), LEDs_DIN (in), LEDs_DOUT (out), LEDs_RCLK (in), LEDs_SCLK (in), Touch_out (out), TTP_VDD (in)

### Nets
+5: C28.2 U8.10(~{MR}) U8.16(VCC)
+24: R39.1 R43.1 R44.1
GND: C26.1 C27.1 C28.1 D12.2(K) D13.2(K) D14.2(K) D15.2(K) Q5.3(E) Q6.3(E) Q7.3(E) Q8.3(E) Q9.3(E) R47.2 R48.2 U7.2(VSS) U8.8(GND) U8.13(~{OE})
LED_ON_OFF: R46.2 ; port LED_ON_OFF
LEDlsb1: R32.2 U8.1(Q1)
LEDlsb2: R34.2 U8.3(Q3)
LEDlsb3: R36.2 U8.5(Q5)
LEDlsb4: R38.2 U8.7(Q7)
LEDmsb1: R31.2 U8.15(Q0)
LEDmsb2: R33.2 U8.2(Q2)
LEDmsb3: R35.2 U8.4(Q4)
LEDmsb4: R37.2 U8.6(Q6)
LEDs_DIN: U8.14(DS) ; port LEDs_DIN
LEDs_DOUT: U8.9(Q7S) ; port LEDs_DOUT
LEDs_RCLK: U8.12(STCP) ; port LEDs_RCLK
LEDs_SCLK: U8.11(SHCP) ; port LEDs_SCLK
red_led: Q9.1(C) R41.2
Touch_out: R45.1 U7.1(Q) ; port Touch_out
TTP_VDD: C26.2 U7.5(VDD) W1.1(C1) W2.2(C2) ; port TTP_VDD
white_led: Q5.1(C) R40.2 R42.2
NetC27_2: C27.2 PAD1.1(T) U7.3(I)
NetD12_1: D12.1(A) R31.1 R32.1
NetD13_1: D13.1(A) R33.1 R34.1
NetD14_1: D14.1(A) R35.1 R36.1
NetD15_1: D15.1(A) R37.1 R38.1
NetLED_P2_1: LED_P2.1 R39.2
NetLED_P2_2: LED_P2.2 R42.1
NetLED_P2_3: LED_P2.3 R41.1
NetLED_P2_4: LED_P2.4 R40.1
NetQ5_2: Q5.2(B) Q6.1(C) R43.2
NetQ6_2: Q6.2(B) R65.2
NetQ7_1: Q7.1(C) Q8.1(C) R44.2 R64.1 R65.1
NetQ7_2: Q7.2(B) R46.1 R48.1
NetQ8_2: Q8.2(B) R45.2 R47.1
NetQ9_2: Q9.2(B) R64.2
NetU7_4: U7.4(AHLB) W2.1(C1)
NetU7_6: U7.6(TOG) W1.2(C2)

### Channels
T1: designators end in _T1; ports LED_ON_OFF=LED_Touch1 LEDs_DIN=LEDs_DI1 LEDs_DOUT=LEDs_DO1 LEDs_RCLK=LEDs_RCLK LEDs_SCLK=LEDs_SCLK Touch_out=touch1 TTP_VDD=TTP_VDD
T2: designators end in _T2; ports LED_ON_OFF=LED_Touch2 LEDs_DIN=LEDs_DI2 LEDs_DOUT=LEDs_DI1 LEDs_RCLK=LEDs_RCLK LEDs_SCLK=LEDs_SCLK Touch_out=touch2 TTP_VDD=TTP_VDD
T3: designators end in _T3; ports LED_ON_OFF=LED_Touch3 LEDs_DIN=LEDs_DI3 LEDs_DOUT=LEDs_DI2 LEDs_RCLK=LEDs_RCLK LEDs_SCLK=LEDs_SCLK Touch_out=touch3 TTP_VDD=TTP_VDD
T4: designators end in _T4; ports LED_ON_OFF=LED_Touch4 LEDs_DIN=LEDs_data LEDs_DOUT=LEDs_DI3 LEDs_RCLK=LEDs_RCLK LEDs_SCLK=LEDs_SCLK Touch_out=touch4 TTP_VDD=TTP_VDD

### Library data of the parts
C26 C28 = Cap: CAP SMD 0603; Published: 8-Jun-2000; LatestRevisionDate: 17-Jul-2002; LatestRevisionNote: Re-released for DXP Platform.; PackageReference: RAD-0.3; Publisher: Altium Limited; PackageDescription: Radial Cap, Thru-Hole; 2 Leads; 0.3 in Pin Spacing; Value: 100nF
C27 = Cap: X7R_NPO; Published: 8-Jun-2000; LatestRevisionDate: 17-Jul-2002; LatestRevisionNote: Re-released for DXP Platform.; PackageReference: RAD-0.3; Publisher: Altium Limited; PackageDescription: Radial Cap, Thru-Hole; 2 Leads; 0.3 in Pin Spacing; Value: 22pF
D12-D15 = LED0: LED SMD 0805 RED; Published: 8-Jun-2000; LatestRevisionDate: 08-Jul-2005; LatestRevisionNote: Mech Layer 1 removed.; PackageReference: LED-0; Publisher: Altium Limited; PackageDescription: LED; 2 Leads
LED_P2 = Header 4: 7led-red white LED pack; LatestRevisionDate: 17-Jul-2002; LatestRevisionNote: Re-released for DXP Platform.; Publisher: Altium Limited
PAD1 = Test Point
Q5-Q9 = 2N2222A: Transistor BJT NPN SMD; pin to pad: 1>3 2>1 3>2; Manufacturer_Name: Foshan Blue Rocket Elec; Datasheet Link: https://datasheet.lcsc.com/szlcsc/1901291437_Foshan-Blue-Rocket-Elec-2N2222A_C358533.pdf; Height: 4.7mm; Manufacturer_Part_Number: 2N2222A
R31-R38 R43-R48 R64 R65 = Resistor: as R20 on sheet top
  R31 R33 R35 R37: Value: 470R
  R32 R34 R36 R38 R45 R46 R64 R65: Value: 1K
  R43 R44 R47 R48: Value: 10K
R39 = Resistor: Fuse 1206; Part Number: RCS0805100KFKEA
R40-R42 = Resistor: as R22 on sheet devices; Value: 1K
U7 = ttp223b: capacitive touch IC
U8 = 74HC595D: 74HC595 SMD; Manufacturer_Name: Nexperia; Datasheet Link: https://componentsearchengine.com/Datasheets/2/74HC595D.pdf; Height: 1.75mm; Manufacturer_Part_Number: 74HC595D; Mouser Part Number: N/A; Mouser Price/Stock: https://www.mouser.com/Search/Refine.aspx?Keyword=N%2FA
W1 W2 = Jumper: Jumper Wire; Published: 24-Mar-1999; LatestRevisionDate: 17-Jul-2002; LatestRevisionNote: Re-released for DXP Platform.; PackageReference: RAD-0.2; Publisher: Altium Limited; PackageDescription: Radial Cap, Thru-Hole; 2 Leads; 0.2 in Pin Spacing

## Nets that join several sheets
3v3: power (C20.2 R19.1 UP1.2 UP1.4), devices (C29.2 C30.2 NRF1.2)
+5: top (Q4.3 R20.1), micro (15 pins), power (6 pins), RS485 (5 pins), white_noise (C31.1 R12.2), devices (22 pins), T1 (C28_T1.2 U8_T1.10 U8_T1.16), T2 (C28_T2.2 U8_T2.10 U8_T2.16), T3 (C28_T3.2 U8_T3.10 U8_T3.16), T4 (C28_T4.2 U8_T4.10 U8_T4.16)
+24: power (C18.1 F3.2 U3.1), white_noise (C15.2 C32.1 R10.2 R11.2), devices (LED_P1.1 LED_P3.1 LED_P4.1 LED_P5.1), T1 (R39_T1.1 R43_T1.1 R44_T1.1), T2 (R39_T2.1 R43_T2.1 R44_T2.1), T3 (R39_T3.1 R43_T3.1 R44_T3.1), T4 (R39_T4.1 R43_T4.1 R44_T4.1)
GND: micro (26 pins), power (14 pins), RS485 (11 pins), white_noise (5 pins), devices (22 pins), T1 (17 pins), T2 (17 pins), T3 (17 pins), T4 (17 pins)
485en: micro (U1.50), RS485 (R5.2)
CS: micro (U1.17), devices (NRF1.4)
DS_INT: micro (U1.42), devices (R21.1 U4.3)
LED_Touch1: micro (U1.75), T1 (R46_T1.2)
LED_Touch2: micro (U1.73), T2 (R46_T2.2)
LED_Touch3: micro (U1.71), T3 (R46_T3.2)
LED_Touch4: micro (U1.69), T4 (R46_T4.2)
LEDs_data: micro (U1.53), T4 (U8_T4.14)
LEDs_DI1: T1 (U8_T1.14), T2 (U8_T2.9)
LEDs_DI2: T2 (U8_T2.14), T3 (U8_T3.9)
LEDs_DI3: T3 (U8_T3.14), T4 (U8_T4.9)
LEDs_RCLK: micro (U1.52), T1 (U8_T1.12), T2 (U8_T2.12), T3 (U8_T3.12), T4 (U8_T4.12)
LEDs_SCLK: micro (U1.51), T1 (U8_T1.11), T2 (U8_T2.11), T3 (U8_T3.11), T4 (U8_T4.11)
MISO: micro (PP1.2 U1.22), devices (NRF1.7)
MOSI: micro (PP1.1 U1.21), devices (NRF1.6)
NetR26_1: micro (U1.23), devices (R26.1 U5.2)
NetR27_1: micro (U1.16), devices (R27.1)
NetR27_2: micro (U1.15), devices (R27.2)
NetR27_3: micro (U1.7), devices (R27.3)
NetR27_4: micro (U1.6), devices (R27.4)
NetR61_1: micro (U1.5), devices (R61.1)
NetSP1_1: micro (U1.1), devices (SP1.1)
NRF_CE: micro (U1.19), devices (NRF1.3)
NRF_IRQ: micro (U1.18), devices (NRF1.8)
NRF_SCK: micro (PP1.3 U1.20), devices (NRF1.5)
photo: micro (U1.94), devices (LDR1.2 POT1.1 POT1.3)
RS48_busy: micro (D8.2 Q3.1 R16.2 U1.77), RS485 (RS1.1 RS2.1)
RX485: micro (U1.45), RS485 (R4.2)
SCL: micro (U1.43), RS485 (I1.1 R8.2), devices (U4.16)
SDA: micro (U1.44), RS485 (I1.2 R9.2), devices (U4.15)
touch_on: top (Q4.2 R20.2), micro (U1.40)
TTP_VDD: top (Q4.1), T1 (C26_T1.2 U7_T1.5 W1_T1.1 W2_T1.2), T2 (C26_T2.2 U7_T2.5 W1_T2.1 W2_T2.2), T3 (C26_T3.2 U7_T3.5 W1_T3.1 W2_T3.2), T4 (C26_T4.2 U7_T4.5 W1_T4.1 W2_T4.2)
TX485: micro (U1.46), RS485 (R7.2 R63.2)
whitenoise: micro (U1.96), white_noise (C16.1 R12.1 R13.2)